# EasyEDA Pro project ProPrj_Fallout_card_2026-06-22.epro

# Schematic Schematic1
Board Name: Board1; Create Date: 2026-06-21; Page Name: P1; Project Name: Fallout_card; Schematic Name: Schematic1; Update Date: 2026-06-21; Company: EasyEDA.com; Page Size: A4; Version: V1.0
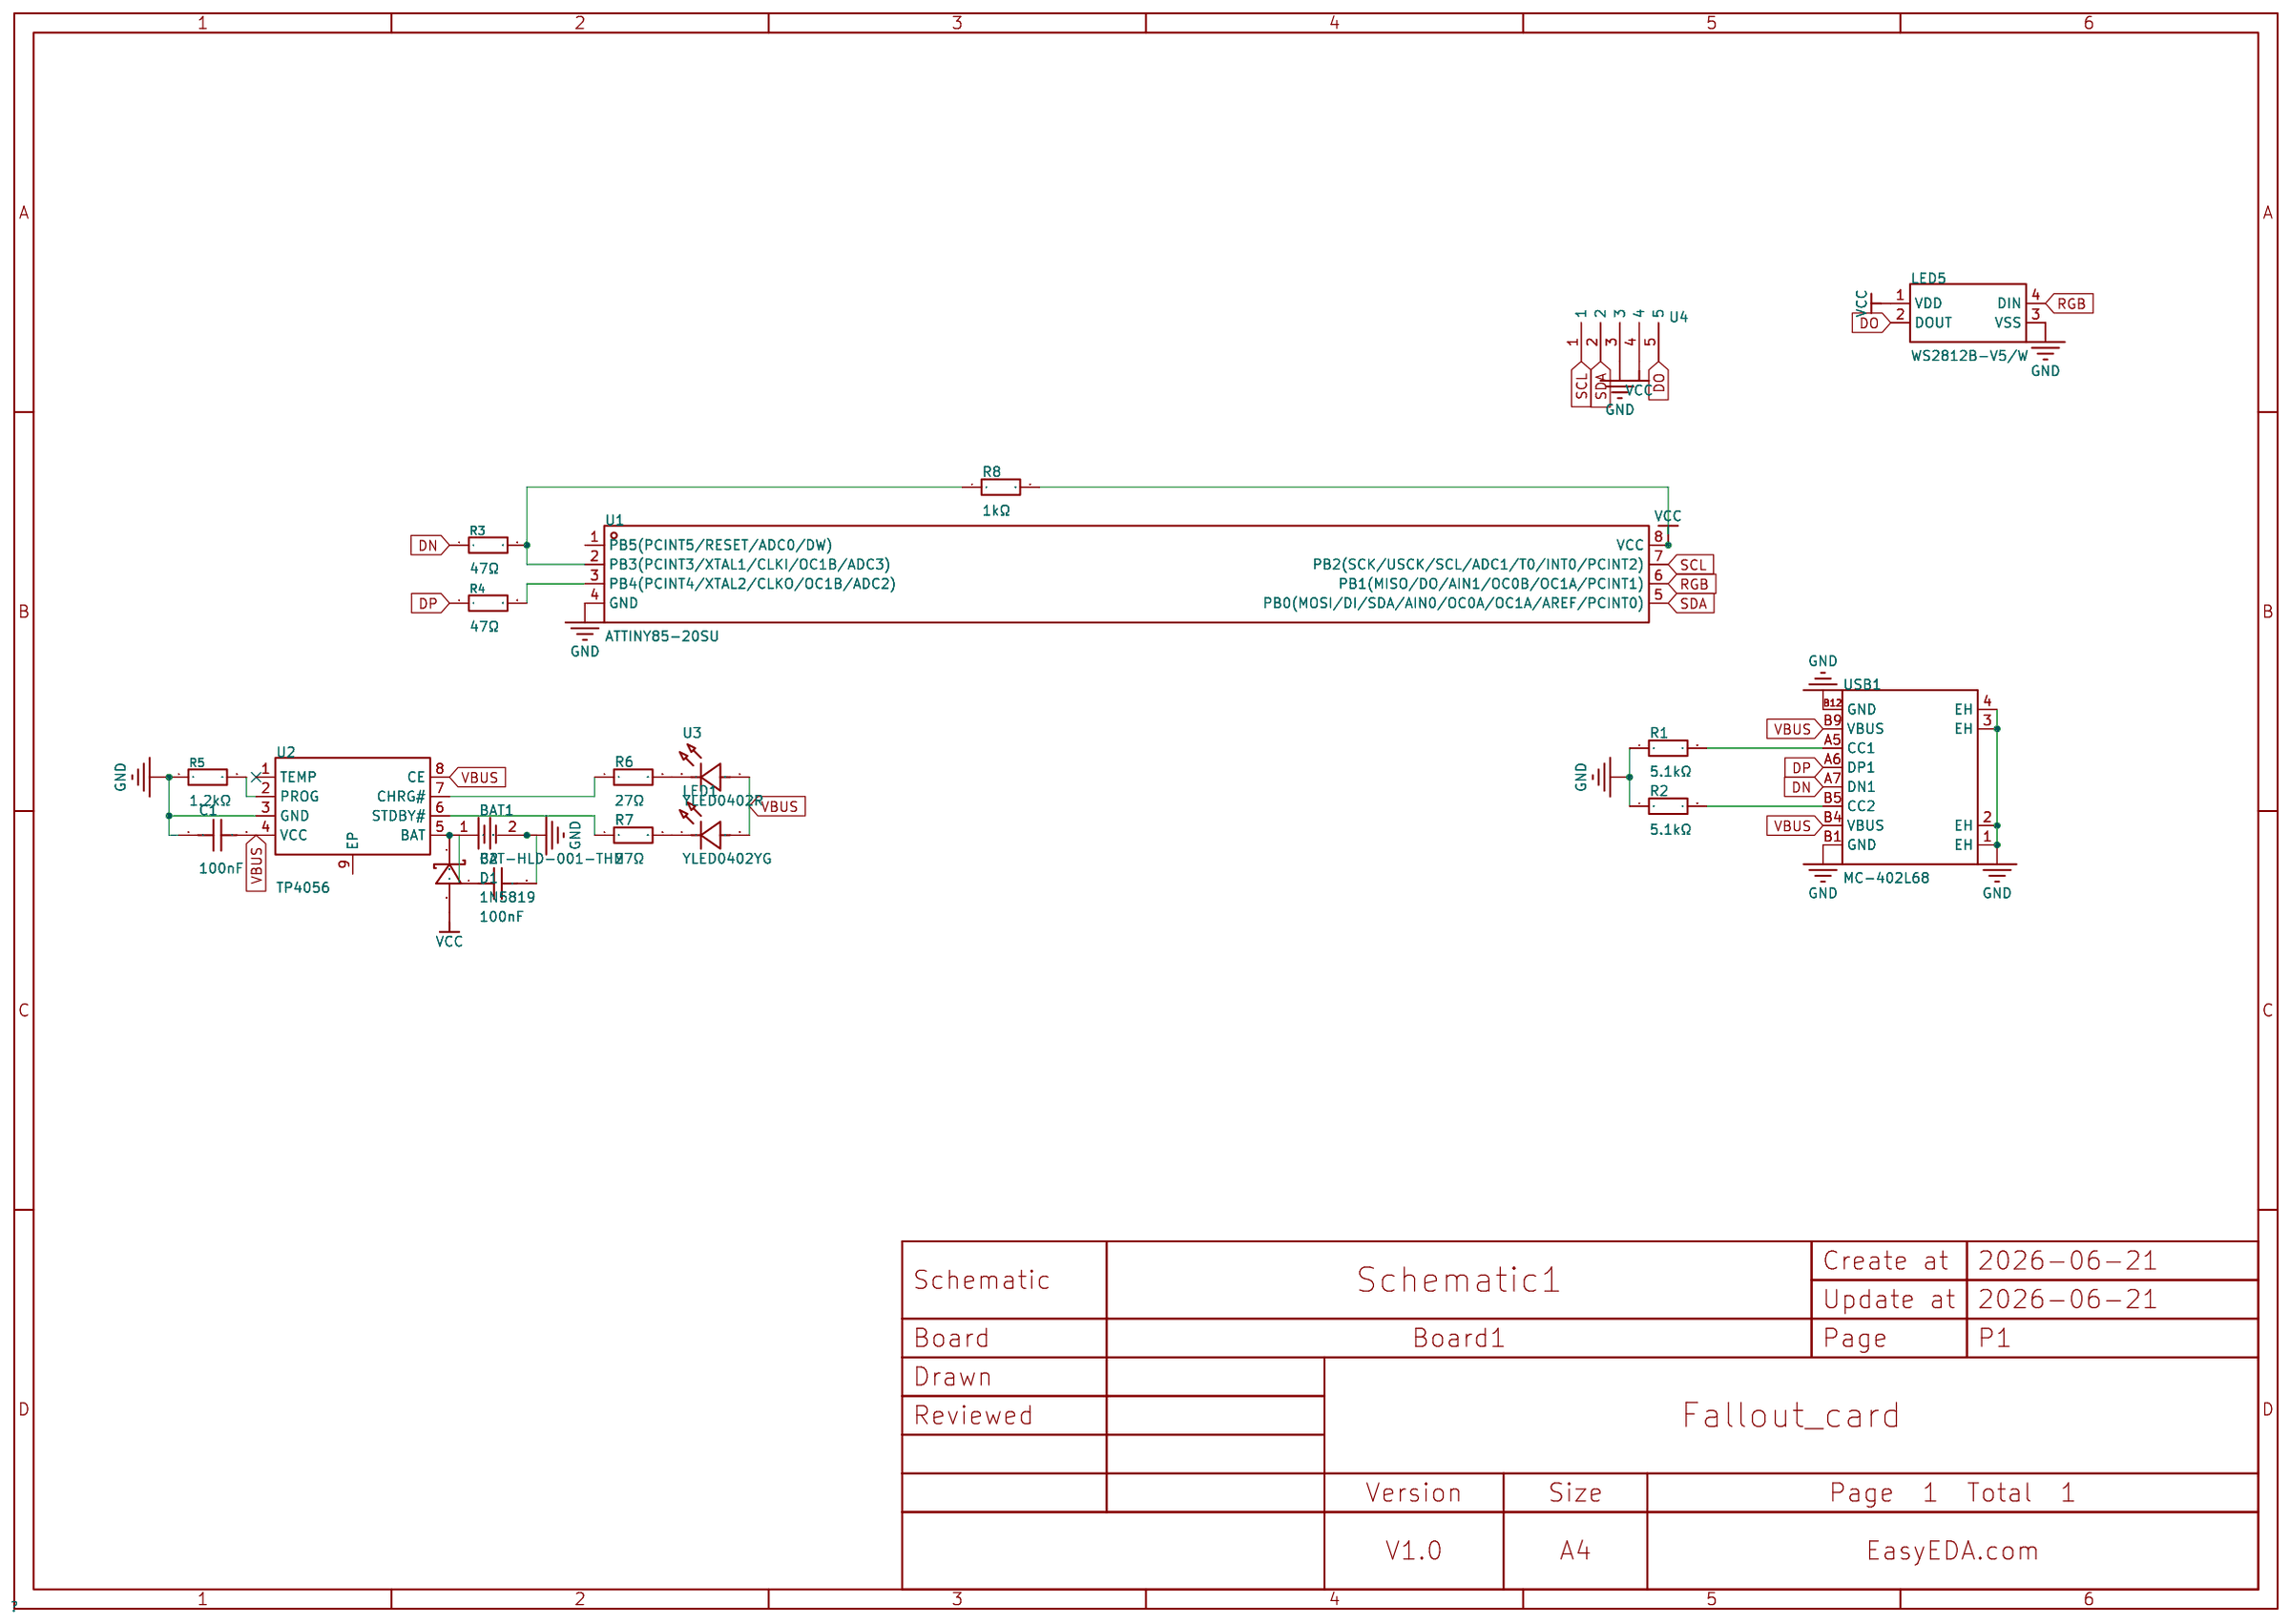
[diagram p0: schematic sheet]

## Parts
BAT1  BAT-HLD-001-THM  [BAT-TH_BAT-HLD-001-THM_1]
C1  100nF  [C0402]
C2  100nF  [C0402]
D1  1N5819  [SMA_L4.4-W2.6-LS5.0-RD]
LED1  YLED0402YG  [LED0402-RD]
LED5  WS2812B-V5/W  [LED-SMD_4P-L5.0-W5.0-TL-1]
R1  5.1kΩ  [R0402]
R2  5.1kΩ  [R0402]
R3  47Ω  [R0402]
R4  47Ω  [R0402]
R5  1.2kΩ  [R0402]
R6  27Ω  [R0402]
R7  27Ω  [R0402]
R8  1kΩ  [R0402]
U1  ATTINY85-20SU  [SOIC-8_L5.3-W5.3-P1.27-LS8.0-BL]
U2  TP4056  [ESOP-8_L4.9-W3.9-P1.27-LS6.0-BL-EP-1]
U3  YLED0402R  [LED0402-R-RD]
U4  -  [PAD'S]
USB1  MC-402L68  [USB-C-SMD_MC-402L68]

## Library data of the parts
BAT1 = BAT-HLD-001-THM: LCSC Part Name: 电池座; Supplier Part: C22417572; Manufacturer: TE Connectivity(泰科电子); Supplier Footprint: 插件; JLCPCB Part Class: Extended Part; Datasheet: https://item.szlcsc.com/datasheet/BAT-HLD-001-THM/24041208.html; Supplier: LCSC
C1 C2 = GRM155B31H104KE14D: Capacitance:100nF Tolerance:±10% Tolerance:±10% Voltage Rating:50V Temperature Coefficient:-; LCSC Part Name: 100nF ±10% 50V; Supplier Part: C85953; Manufacturer: muRata(村田); Supplier Footprint: 0402; JLCPCB Part Class: Extended Part; Datasheet: https://item.szlcsc.com/datasheet/GRM155B31H104KE14D/87129.html; Supplier: LCSC; Tolerance: ±10%; Voltage Rating: 50V
D1 = 1N5819_C437199: Diode Configuration:1 Independent Voltage - Forward(Vf@If):- Voltage - DC Reverse(Vr):40V Current - Rectified:1A Reverse Leakage Current (Ir):- Operating Junction Temperature Range:-60℃~+125℃ Operating Junction Temperature Range:-60℃~+125℃ Non-Repetitive; LCSC Part Name: KEXIN(科信)原型号 SS14,后续变更为 1N5819，丝印不变。 电压:40V 电流:1A; Supplier Part: C437199; Manufacturer: KEXIN(科信); Supplier Footprint: DO-214AC(SMA); JLCPCB Part Class: Extended Part; Datasheet: https://item.szlcsc.com/datasheet/1N5819/435098.html; Supplier: LCSC; Diode Configuration: 1 Independent; Voltage - DC Reverse(Vr): 40V; Current - Rectified: 1A; Operating Junction Temperature Range: -60℃~+125℃; Non-Repetitive Peak Forward Surge Current: 40A
LED1 = YLED0402YG: Lamp Holder Type:- Illumination Color:Yellow Green Voltage - Forward(Vf):1.8V~2.4V Voltage - Forward(Vf):1.8V~2.4V Power(Watts):60mW Forward Current:20mA Wavelength - Dominant:568nm~576nm Wavelength - Dominant:568nm~576nm Peak Wavelength:578nm Peak Wavele; LCSC Part Name: 发光管; Supplier Part: C20608783; Manufacturer: YONGYUTAI(永裕泰); Supplier Footprint: 0402; JLCPCB Part Class: Extended Part; Datasheet: https://item.szlcsc.com/datasheet/YLED0402YG/21958290.html; Supplier: LCSC; Illumination Color: Yellow Green; Voltage - Forward(Vf): 1.8V~2.4V; Power(Watts): 60mW; Forward Current: 20mA; Wavelength - Dominant: 568nm~576nm; Peak Wavelength: 578nm; Diode Configuration: Discrete Diode; Lens Color: Water Clear; Luminous Intensity: 85mcd; Viewing Angle: 120°; Operating Temperature: -40℃~+85℃
LED5 = WS2812B-V5/W: Wavelength:R:620nm~630nm；B:465nm~475nm；G:515nm~525nm Luminous Intensity:R:310mcd；B:215mcd；G:780mcd Fixed-Frequency Pwm Mode:2kHz Data Transmission Rate:800Kbit/s Voltage - Supply:5V Voltage - Supply:5V Quiescent Current:0.6mA Lens Color:White Frosted Lens; LCSC Part Name: RGB三色; Supplier Part: C2874885; Manufacturer: worldsemi; Supplier Footprint: SMD5050-4P; JLCPCB Part Class: Extended Part; Datasheet: https://item.szlcsc.com/datasheet/WS2812B-V5%252FW/3081328.html; Supplier: LCSC; Wavelength: R:620nm~630nm；B:465nm~475nm；G:515nm~525nm; Luminous Intensity: R:310mcd；B:215mcd；G:780mcd; Fixed-Frequency Pwm Mode: 2kHz; Data Transmission Rate: 800Kbit/s; Voltage - Supply: 5V; Quiescent Current: 0.6mA; Lens Color: White Frosted Lens; Operating Temperature: -40℃~+65℃; Length: 5mm; Width: 1.57mm; Height: 5.4mm; Features: Built-in power-on reset circuit；Integrated intelligent reverse connection protection function；Built-in power-on reset circuit
R1 R2 = RMC04025.1K5%N: Type:Thick Film Resistor Resistance:5.1kΩ Tolerance:±5% Tolerance:±5% Power(Watts):62.5mW Voltage-Supply(Max):50V Temperature Coefficient:±100ppm/℃ Temperature Coefficient:±100ppm/℃ Operating Temperature:-55℃~+155℃ Operating Temperature:-55℃~+155℃; LCSC Part Name: 厚膜电阻 5.1kΩ ±5% 62.5mW; Supplier Part: C325524; Manufacturer: Tyohm(幸亚电阻); Supplier Footprint: 0402; JLCPCB Part Class: Extended Part; Datasheet: https://item.szlcsc.com/datasheet/RMC04025.1K5%2525N/305729.html; Supplier: LCSC; Type: Thick Film Resistor; Tolerance: ±5%; Power(Watts): 62.5mW; Voltage-Supply(Max): 50V; Temperature Coefficient: ±100ppm/℃; Operating Temperature: -55℃~+155℃
R3 R4 = RTT0247R0FTH: Type:Thick Film Resistors Resistance: Tolerance:±1% Tolerance:±1% Power(Watts): Overload Voltage (Max): Temperature Coefficient:±100ppm/℃ Temperature Coefficient:±100ppm/℃ Operating Temperature Range:-55℃~+155℃ Operating Temperature Range:-55℃~+155℃; LCSC Part Name: 厚膜电阻 47Ω ±1% 62.5mW; Supplier Part: C103066; Manufacturer: RALEC(旺诠); Supplier Footprint: 0402; JLCPCB Part Class: Extended Part; Datasheet: https://atta.szlcsc.com/upload/public/pdf/source/20191219/C158410_884373A5B7E1BC76BF57BC45A946C093.pdf; Supplier: LCSC; Type: Thick Film Resistors; Tolerance: ±1%; Temperature Coefficient: ±100ppm/℃; Operating Temperature Range: -55℃~+155℃
R5 = RMC04021.2K5%N: Resistance: Tolerance:±5% Tolerance:±5% Power(Watts):; LCSC Part Name: 1.2kΩ ±5% 62.5mW; Supplier Part: C325564; Manufacturer: Tyohm(幸亚电阻); Supplier Footprint: 0402; JLCPCB Part Class: Extended Part; Datasheet: https://atta.szlcsc.com/upload/public/pdf/source/20190115/C325956_D27151D492FFB3C9AB4A6F14FE01F30A.pdf; Supplier: LCSC; Tolerance: ±5%
R6 R7 = RMS04JT270: Type:Thick Film Resistor Resistance:27Ω Tolerance:±5% Tolerance:±5% Power(Watts):62.5mW Voltage-Supply(Max):50V Temperature Coefficient:±200ppm/℃ Temperature Coefficient:±200ppm/℃ Operating Temperature:-55℃~+155℃ Operating Temperature:-55℃~+155℃; LCSC Part Name: 厚膜电阻 27Ω ±5% 62.5mW; Supplier Part: C208978; Manufacturer: 大毅科技; Supplier Footprint: 0402; JLCPCB Part Class: Extended Part; Datasheet: https://item.szlcsc.com/datasheet/RMS04JT270/210013.html; Supplier: LCSC; Type: Thick Film Resistor; Tolerance: ±5%; Power(Watts): 62.5mW; Voltage-Supply(Max): 50V; Temperature Coefficient: ±200ppm/℃; Operating Temperature: -55℃~+155℃
R8 = RT0402FRE071KL: Type:Thin Film Resistor Resistance:1kΩ Tolerance:±1% Tolerance:±1% Power(Watts):62.5mW Voltage-Supply(Max):50V Temperature Coefficient:±50ppm/℃ Temperature Coefficient:±50ppm/℃ Operating Temperature:-55℃~+155℃ Operating Temperature:-55℃~+155℃; LCSC Part Name: 薄膜电阻 1kΩ ±1% 62.5mW; Supplier Part: C136974; Manufacturer: YAGEO(国巨); Supplier Footprint: 0402; JLCPCB Part Class: Extended Part; Datasheet: https://item.szlcsc.com/datasheet/RT0402FRE071KL/148290.html; Supplier: LCSC; Type: Thin Film Resistor; Tolerance: ±1%; Power(Watts): 62.5mW; Voltage-Supply(Max): 50V; Temperature Coefficient: ±50ppm/℃; Operating Temperature: -55℃~+155℃
U1 = ATTINY85-20SU_C31540447: Supplier Part: C31540447; Manufacturer: MICROCHIP(美国微芯); Supplier Footprint: SOIC-8-208mil; JLCPCB Part Class: Extended Part; Datasheet: https://item.szlcsc.com/datasheet/ATTINY85-20SU/33275182.html; Supplier: LCSC
U2 = TP4056_C49045948: The Chip Type:Charging IC Voltage - Supply:4V~6V Voltage - Supply:4V~6V Charge Current - Max:1.2A Charging Saturation Voltage:4.2V End-Off Voltage:- Type of Battery:Lithium Battery Number of Cells:1 Number of Cells:1 Operating Temperature:-40℃~+85℃ Operat; LCSC Part Name: 1.2A锂电池线性充电芯片; Supplier Part: C49045948; Manufacturer: HICHON(海川); Supplier Footprint: ESOP-8L; JLCPCB Part Class: Extended Part; Datasheet: https://item.szlcsc.com/datasheet/TP4056/51406851.html; Supplier: LCSC; The Chip Type: Charging IC; Voltage - Supply: 4V~6V; Charge Current - Max: 1.2A; Charging Saturation Voltage: 4.2V; Type of Battery: Lithium Battery; Number of Cells: 1; Operating Temperature: -40℃~+85℃; Battery Temperature Detection: Support; 0V Battery Charge: Support; Supply Current (Iq): 45uA; Features: Constant voltage charging；Constant current charging；Automatic recharge；Charge termination；Soft-start；Programmable charging current；Under-voltage lockout；Trickle charging
U3 = YLED0402R: Lamp Holder Type:- Illumination Color:Red Voltage - Forward(Vf):1.8V~2.4V Voltage - Forward(Vf):1.8V~2.4V Power(Watts):60mW Forward Current:20mA Wavelength - Dominant:615nm~630nm Wavelength - Dominant:615nm~630nm Peak Wavelength:645nm Peak Wavelength:645n; LCSC Part Name: 发光管; Supplier Part: C21260817; Manufacturer: YONGYUTAI(永裕泰); Supplier Footprint: 0402; JLCPCB Part Class: Extended Part; Datasheet: https://item.szlcsc.com/datasheet/YLED0402R/22678288.html; Supplier: LCSC; Illumination Color: Red; Voltage - Forward(Vf): 1.8V~2.4V; Power(Watts): 60mW; Forward Current: 20mA; Wavelength - Dominant: 615nm~630nm; Peak Wavelength: 645nm; Diode Configuration: Discrete Diode; Lens Color: Water Clear; Luminous Intensity: 250mcd; Viewing Angle: 120°; Operating Temperature: -40℃~+85℃
U4 = pad's for tiny mcu
USB1 = MC-402L68: Connector Type:Type-C Gender:Female Mounting Type:Surface Mount, Right Angle Number of Contacts:8P Number of Ports:1 Current Rating-Power:3A Voltage Rating:5V Connect-Disconnect Life:10,000 Cycles Length:6.8mm Operating Temperature:-25℃~+85℃ Operating Tem; LCSC Part Name: Type-C 母 卧贴; Supplier Part: C47326494; Manufacturer: HANBO(汉博); Supplier Footprint: SMD; JLCPCB Part Class: Extended Part; Datasheet: https://item.szlcsc.com/datasheet/MC-402L68/49535999.html; Supplier: LCSC; Connector Type: Type-C; Gender: Female; Mounting Type: Surface Mount, Right Angle; Number of Contacts: 8P; Number of Ports: 1; Current Rating-Power: 3A; Voltage Rating: 5V; Connect-Disconnect Life: 10,000 Cycles; Length: 6.8mm; Operating Temperature: -25℃~+85℃

## Nets
GND: BAT1.2 C1.1 C2.2 LED5.3(VSS) R1.1 R2.1 R5.1 U1.4(GND) U2.3(GND) U4.3 USB1.1(EH) USB1.2(EH) USB1.3(EH) USB1.4(EH) USB1.B1(GND) USB1.B12(GND)
VBUS: C1.2 LED1.2(A) U2.4(VCC) U2.8(CE) U3.1(A) USB1.B4(VBUS) USB1.B9(VBUS)
VCC: D1.2(A) LED5.1(VDD) R8.2 U1.8(VCC) U4.4
DN: R3.1 USB1.A7(DN1)
DO: LED5.2(DOUT) U4.5
DP: R4.1 USB1.A6(DP1)
RGB: LED5.4(DIN) U1.6(PB1(MISO/DO/AIN1/OC0B/OC1A/PCINT1))
SCL: U1.7(PB2(SCK/USCK/SCL/ADC1/T0/INT0/PCINT2)) U4.1
SDA: U1.5(PB0(MOSI/DI/SDA/AIN0/OC0A/OC1A/AREF/PCINT0)) U4.2
$1N36: R2.2 USB1.B5(CC2)
$1N37: R1.2 USB1.A5(CC1)
$1N42: R3.2 R8.1 U1.2(PB3(PCINT3/XTAL1/CLKI/OC1B/ADC3))
$1N43: R4.2 U1.3(PB4(PCINT4/XTAL2/CLKO/OC1B/ADC2))
$1N50: R5.2 U2.2(PROG)
$1N52: R6.1 U2.7(CHRG#)
$1N53: R7.1 U2.6(STDBY#)
$1N56: R6.2 U3.2(K)
$1N57: LED1.1(K) R7.2
$1N61: BAT1.1 C2.1 D1.1(C) U2.5(BAT)

Not connected (* = marked no-connect by the designer): U1 1(PB5(PCINT5/RESET/ADC0/DW)); U2 1(TEMP)* 9(EP)

# Board PCB1
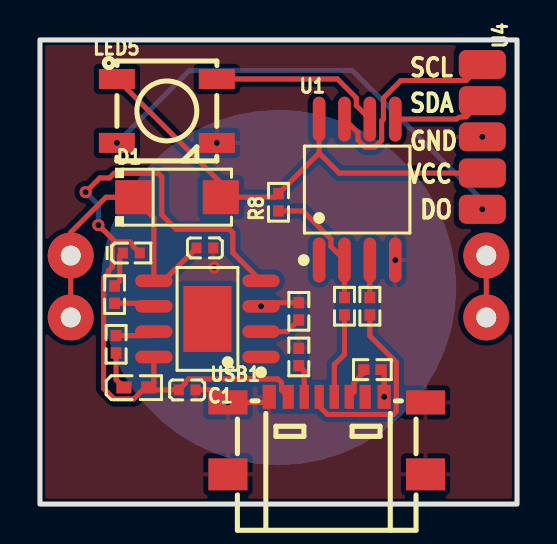
[diagram p1: board, top side]
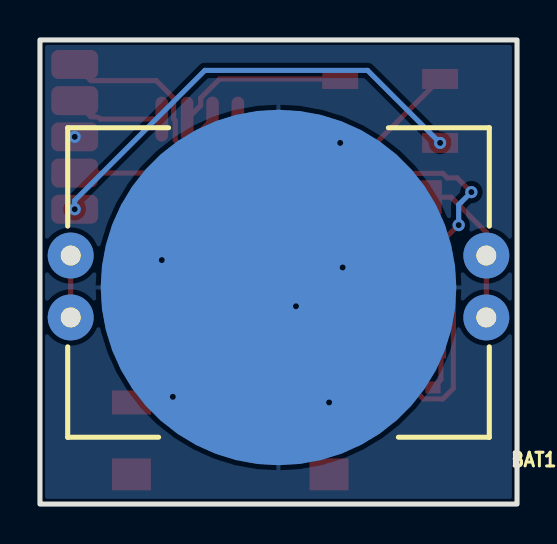
[diagram p2: board, bottom side, seen from below]

Outline 23.88 x 23.24 mm; copper layers: Top Layer, Bottom Layer. Coordinates in mm from the lower left corner of the outline.
Outline path: rectangle 0,23.24 23.88,0
Stack: Top Layer 0.035mm / Dielectric1 1.51mm FR4 er 4.5 / Bottom Layer 0.035mm

## Design rules (mm)
net DN: DP1
net DP: DP1
spacing copperThickness1oz (default): track to track 0.102, other pairs 0.152 to 0.3
spacing copperThickness2oz: track to track 0.203, other pairs 0.152 to 0.3
track width copperThickness1oz (default): min 0.127, default 0.254, max 2.54
track width copperThickness2oz: min 0.203, default 0.254, max 2.54
differential pair differentialPair (default): width min 0.127, default 0.254, max 2.54; gap min 0.152, default 0.152
net GND uses copperRegion

## Placement (name value [footprint] x y rotation side)
BAT1  BAT-HLD-001-THM  [BAT-TH_BAT-HLD-001-THM_1]  11.94 10.89 0 bottom
C1  100nF  [C0402]  7.37 5.72 180 top
C2  100nF  [C0402]  8.25 12.83 0 top
D1  1N5819  [SMA_L4.4-W2.6-LS5.0-RD]  6.86 15.37 0 top
LED1  YLED0402YG  [LED0402-RD]  4.57 12.57 0 top
LED5  WS2812B-V5/W  [LED-SMD_4P-L5.0-W5.0-TL-1]  6.35 19.69 0 top
R1  5.1kΩ  [R0402]  12.95 7.37 270 top
R2  5.1kΩ  [R0402]  16.64 6.73 180 top
R3  47Ω  [R0402]  15.24 9.91 90 top
R4  47Ω  [R0402]  16.51 9.91 90 top
R5  1.2kΩ  [R0402]  12.95 9.65 270 top
R6  27Ω  [R0402]  3.81 8 270 top
R7  27Ω  [R0402]  3.74 10.49 90 top
R8  1kΩ  [R0402]  11.94 15.11 90 top
U1  ATTINY85-20SU  [SOIC-8_L5.3-W5.3-P1.27-LS8.0-BL]  15.88 15.75 0 top
U2  TP4056  [ESOP-8_L4.9-W3.9-P1.27-LS6.0-BL-EP-1]  8.38 9.27 90 top
U3  YLED0402R  [LED0402-R-RD]  4.83 5.84 0 top
U4  -  [PAD'S]  20.89 22.76 270 top
USB1  MC-402L68  [USB-C-SMD_MC-402L68]  14.35 3.43 0 top

## Footprints (pads in the part's own frame, mm; a bottom-side part is the same pattern mirrored in y, then rotated)
BAT-TH_BAT-HLD-001-THM_1
  round 2.3 hole 1: 1(-10.4,-1.55) 1(-10.4,1.55) 1(10.4,-1.55) 1(10.4,1.55)
  custom 17.8x17.8 smd: 2(0,0.05)
C0402
  rect 0.5x0.54 smd: 1(-0.42,0) 2(0.42,0)
ESOP-8_L4.9-W3.9-P1.27-LS6.0-BL-EP-1
  oval 0.63x1.865 smd: 1(-1.905,-2.683) 2(-0.635,-2.683) 3(0.635,-2.683) 4(1.905,-2.683) 5(1.905,2.683) 6(0.635,2.683) 7(-0.635,2.683) 8(-1.905,2.683)
  rect 3.3x2.4 smd: 9(0,0)
LED0402-R-RD
  rect 0.75x0.6 smd: 1(0.623,0) 2(-0.623,0)
LED0402-RD
  rect 0.5x0.54 smd: 1(-0.425,0) 2(0.425,0)
LED-SMD_4P-L5.0-W5.0-TL-1
  rect 1.8x1 smd: 1(-2.5,1.6) 2(-2.5,-1.6) 3(2.5,-1.6) 4(2.5,1.6)
PAD'S
  rrect 1.45x2.35 smd: 1(0.75,1.25) 2(2.562,1.25) 3(4.375,1.25) 4(6.188,1.25) 5(8,1.25)
R0402
  rect 0.566x0.54 smd: 1(-0.433,0) 2(0.433,0)
SMA_L4.4-W2.6-LS5.0-RD
  rect 1.8x1.7 smd: 1(-2.192,0) 2(2.192,0)
SOIC-8_L5.3-W5.3-P1.27-LS8.0-BL
  oval 0.63x2.25 smd: 1(-1.905,-3.53) 2(-0.635,-3.53) 3(0.635,-3.53) 4(1.905,-3.53) 5(1.905,3.53) 6(0.635,3.53) 7(-0.635,3.53) 8(-1.905,3.53)
USB-C-SMD_MC-402L68
  rect 1.95x1.2 smd: 1(-4.945,1.66) 4(4.945,1.66)
  rect 1.95x1.6 smd: 2(-4.945,-1.94) 3(4.945,-1.94)
  rect 0.46x1.2 smd: A5(-1.125,1.94) A6(-0.375,1.94) A7(0.375,1.94) B5(1.125,1.94)
  rect 0.66x1.2 smd: B1(2.875,1.94) B12(-2.875,1.94)
  rect 0.56x1.2 smd: B4(1.925,1.94) B9(-1.925,1.94)

## Nets
As in the schematic.

Pads without a net: U1 1; U2 1 9

## Via types
v1: diameter 0.61, hole 0.305, Top Layer to Bottom Layer, 11 vias

## Routing (per net, layer and track width the routed paths; a pad name or vN(x,y) marks a point on that pad's centre or on a via; arc(x,y) is an arc through that point)
GND: length 7.5
  Top Layer w0.254: R2.1 17.23,6.58 v1(17.23,5.37) ; USB1.B12 11.2,5.09 v1(9.41,5.09) 8.78,5.72 C1.1 ; 12.95,10.08 11.24,10.08 v1(11.06,9.91)
  vias: v1(8.73,11.85) v1(8.85,18.08) v1(17.78,12.22) v1(22.14,18.39)
VBUS: length 37.5
  Top Layer w0.254: U3.1 5.58,5.72 6.95,5.72 7.26,6.03 7.26,6.1 7.42,6.26 11.91,6.26 12.09,6.08 12.09,5.71 USB1.B9 ; U3.1 5.27,5.84 4.69,5.26 3.71,5.26 3.19,5.79 3.19,11.32 3.43,11.56 3.43,11.68 3.62,11.87 3.62,12.96 3.78,13.12 ; U3.1 5.7,6.09 U2.8 ; v1(2.92,13.97) 2.93,13.97 3.78,13.12 ; 3.78,13.12 4.51,13.12 4.68,12.96 4.68,12.89 LED1.2 ; v1(2.29,15.62) 3,16.33 3.49,16.33 3.72,16.56 5.92,16.56 6.1,16.38 6.1,14.48 6.81,13.77 9.47,13.77 9.65,13.59 9.65,12.59 U2.4
  Bottom Layer w0.254: v1(2.29,15.62) 2.92,14.99 v1(2.92,13.97)
VCC: length 24.2
  Top Layer w0.254: LED5.1 9.05,16.08 D1.2 11.76,15.37 R8.2 13.97,17.58 ; 13.97,17.58 U1.8 ; 13.97,17.58 14.97,16.58 U4.4
DN: length 4.3
  Top Layer w0.254: USB1.A7 14.73,5.38 14.73,6.98 15.24,7.49 R3.1
DO: length 22.9
  Bottom Layer w0.254: v1(3.85,18.08) 7.48,21.72 15.62,21.72 22.14,15.2 v1(22.14,14.76)
DP: length 9.9
  Top Layer w0.254: USB1.A6 13.98,4.89 14.38,4.49 17.67,4.49 17.84,4.65 17.84,7.1 16.51,8.42 R4.1
RGB: length 8.7
  Top Layer w0.254: LED5.4 14.88,21.28 15.83,20.33 15.83,19.95 U1.6
SCL: length 10.6
  Top Layer w0.254: U1.7 15.92,18.6 15.92,18.22 16.26,17.87 16.76,17.87 17.1,18.22 17.1,19.2 17.19,19.28 17.19,20.33 18.06,21.2 21.33,21.2 U4.1
SDA: length 4.7
  Top Layer w0.254: U4.2 21.33,19.39 21.14,19.39 arc(20.98,19.36) 20.84,19.28 U1.5
$1N36: length 1.7
  Top Layer w0.254: USB1.B5 15.72,5.61 15.72,6.08 16.2,6.57 R2.2
$1N37: length 1.7
  Top Layer w0.254: USB1.A5 13.23,6.66 R1.2
$1N42: length 6.4
  Top Layer w0.254: R3.2 U1.2 14.56,12.89 14.56,13.27 13.16,14.68 R8.1
$1N43: length 1.9
  Top Layer w0.254: R4.2 U1.3
$1N50: length 2.1
  Top Layer w0.254: R5.2 12.37,8.64 U2.2
$1N52: length 2
  Top Layer w0.254: U2.7 5.5,8.43 R6.1
$1N53: length 2
  Top Layer w0.254: R7.1 5.55,10.06 U2.6
$1N56: length 1.9
  Top Layer w0.254: R6.2 3.81,6.23 U3.2
$1N57: length 1.8
  Top Layer w0.254: LED1.1 3.99,12.42 3.99,11.18 R7.2
$1N61: length 18.7
  Top Layer w0.254: BAT1.1 BAT1.1 1.54,13.6 3.3,15.37 D1.1 5.7,14.33 U2.5 6.18,11.18 C2.1 ; BAT1.1 BAT1.1

## Copper pours and planes (outline as drawn; the poured copper is in the pictures)
GND on Top Layer: 0,23.24 23.88,23.24 23.88,0 0,0
GND on Bottom Layer: 0,23.24 23.88,23.24 23.88,0 0,0

## Text on the board
Top Silkscreen Layer: VCC | SCL | SDA | GND | DO
